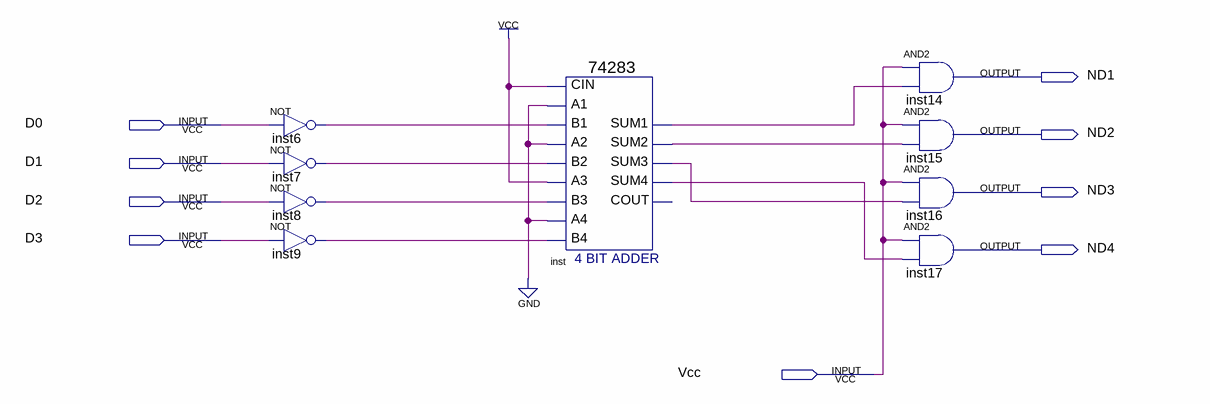
[diagram p0: schematic sheet]
// Quartus schematic TransYellow.bdf as structural Verilog: 9 symbols, 9 pins
module TransYellow (
  input  D0,
  input  D1,
  input  D2,
  input  D3,
  input  Vcc,
  output ND1,
  output ND2,
  output ND3,
  output ND4
);

  wire inst6_out, inst7_out, inst8_out, inst9_out, inst_sum1, inst_sum2, inst_sum3, inst_sum4;

  not inst6 (inst6_out, D0);
  not inst7 (inst7_out, D1);
  not inst8 (inst8_out, D2);
  not inst9 (inst9_out, D3);
  \74283  inst (
    .CIN(1'b1), .A1(1'b0), .A2(1'b0), .B2(inst7_out), .A3(1'b1), .A4(1'b0), .B4(inst9_out), .B1(inst6_out),
    .B3(inst8_out), .SUM4(inst_sum4), .SUM1(inst_sum1), .SUM2(inst_sum2), .SUM3(inst_sum3));  // open: COUT
  and inst14 (ND1, Vcc, inst_sum1);
  and inst15 (ND2, Vcc, inst_sum2);
  and inst16 (ND3, Vcc, inst_sum3);
  and inst17 (ND4, Vcc, inst_sum4);
endmodule
